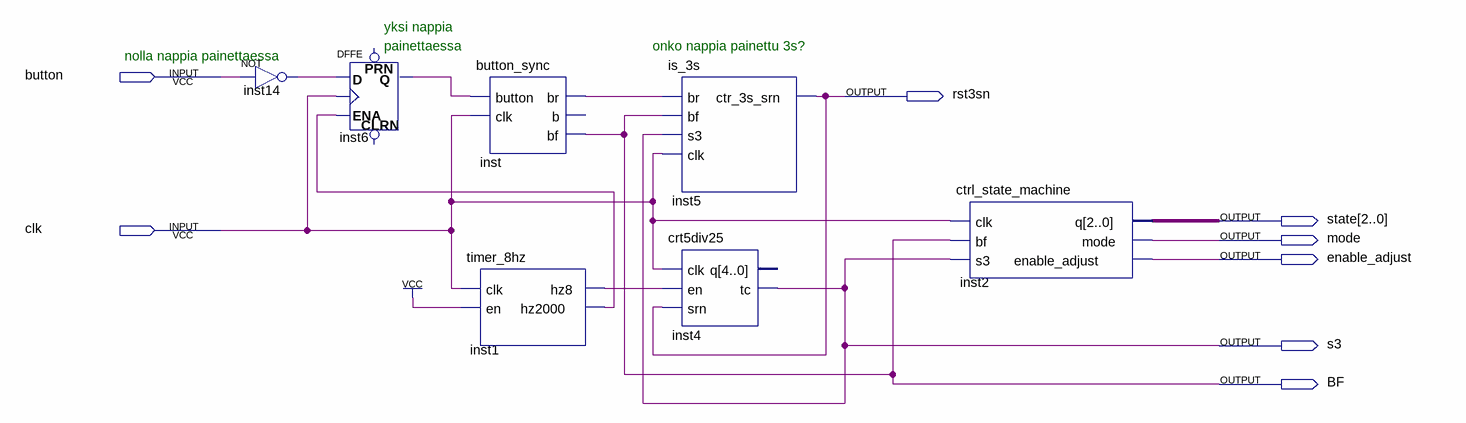
[diagram p0: schematic sheet]
// Quartus schematic mode_control.bdf as structural Verilog: 7 symbols, 8 pins
module mode_control (
  input  button,
  input  clk,
  output rst3sn,
  output [2:0] state,
  output mode,
  output enable_adjust,
  output s3,
  output BF
);

  wire inst1_hz8, inst1_hz2000, inst6_q, inst14_out, inst_br;

  not inst14 (inst14_out, button);
  DFFE inst6 (.D(inst14_out), .CLK(clk), .ENA(inst1_hz2000), .Q(inst6_q));  // open: PRN, CLRN
  button_sync inst (.button(inst6_q), .clk(clk), .br(inst_br), .bf(BF));  // open: b
  timer_8hz inst1 (.clk(clk), .en(1'b1), .hz8(inst1_hz8), .hz2000(inst1_hz2000));
  is_3s inst5 (.br(inst_br), .bf(BF), .s3(s3), .clk(clk), .ctr_3s_srn(rst3sn));
  crt5div25 inst4 (.clk(clk), .en(inst1_hz8), .srn(rst3sn), .tc(s3));  // open: q
  ctrl_state_machine inst2 (.clk(clk), .bf(BF), .s3(s3), .q(state), .mode(mode), .enable_adjust(enable_adjust));

  // Notes on the sheet:
  //   yksi nappia
  //   painettaessa
  //   onko nappia painettu 3s?
  //   nolla nappia painettaessa
endmodule
